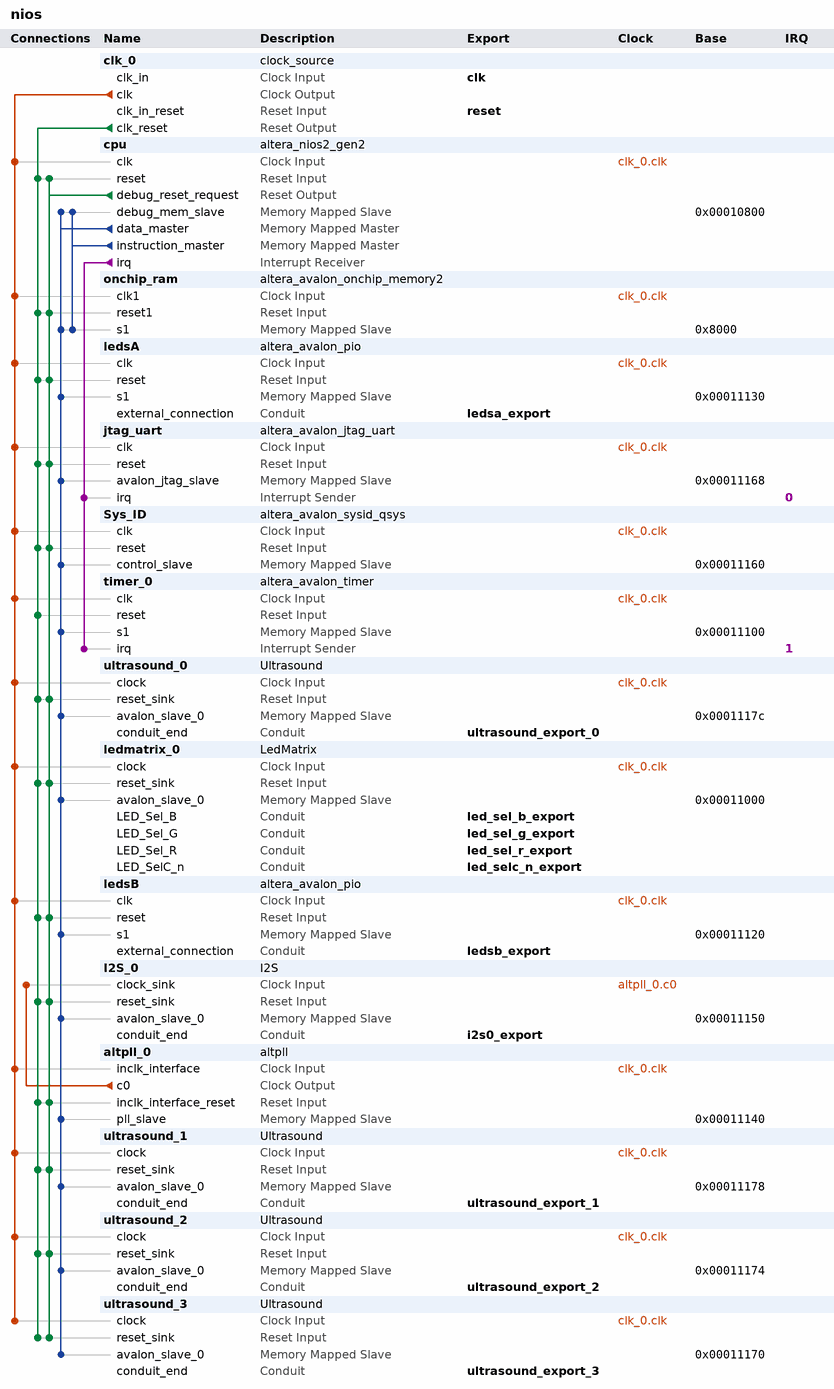
[diagram p0: system contents]
# Platform Designer (Qsys) system nios, Cyclone IV E EP4CE22F17C6
# Parameters at their usual value, and those the tool derives, are not listed.
package require -exact qsys 17.0
create_system nios
set_project_property DEVICE_FAMILY {Cyclone IV E}
set_project_property DEVICE EP4CE22F17C6

add_instance clk_0 clock_source 17.0
set_instance_parameter_value clk_0 clockFrequency 50000000

add_instance cpu altera_nios2_gen2 17.0
set_instance_parameter_value cpu dcache_size 2048
set_instance_parameter_value cpu exceptionSlave onchip_ram.s1
set_instance_parameter_value cpu icache_size 4096
set_instance_parameter_value cpu impl Fast
set_instance_parameter_value cpu resetSlave onchip_ram.s1

add_instance onchip_ram altera_avalon_onchip_memory2 17.0
set_instance_parameter_value onchip_ram dataWidth 32
set_instance_parameter_value onchip_ram dualPort false
set_instance_parameter_value onchip_ram initMemContent true
set_instance_parameter_value onchip_ram initializationFileName onchip_mem.hex
set_instance_parameter_value onchip_ram memorySize 32768

add_instance ledsA altera_avalon_pio 17.0
set_instance_parameter_value ledsA direction Output
set_instance_parameter_value ledsA width 8

add_instance jtag_uart altera_avalon_jtag_uart 17.0
set_instance_parameter_value jtag_uart simInteractiveOptions NO_INTERACTIVE_WINDOWS

add_instance Sys_ID altera_avalon_sysid_qsys 17.0
set_instance_parameter_value Sys_ID id 0

add_instance timer_0 altera_avalon_timer 17.0
set_instance_parameter_value timer_0 period 100
set_instance_parameter_value timer_0 periodUnits USEC

add_instance ultrasound_0 Ultrasound 1.0

add_instance ledmatrix_0 LedMatrix 1.0
set_instance_parameter_value ledmatrix_0 size 16

add_instance ledsB altera_avalon_pio 17.0
set_instance_parameter_value ledsB direction Output
set_instance_parameter_value ledsB width 8

add_instance I2S_0 I2S 1.0

add_instance altpll_0 altpll 17.0
set_instance_parameter_value altpll_0 CLK0_DIVIDE_BY 3125
set_instance_parameter_value altpll_0 CLK0_MULTIPLY_BY 512
set_instance_parameter_value altpll_0 INCLK0_INPUT_FREQUENCY 20000
set_instance_parameter_value altpll_0 PORT_ARESET PORT_UNUSED
set_instance_parameter_value altpll_0 PORT_LOCKED PORT_UNUSED
set_instance_parameter_value altpll_0 PORT_clk1 PORT_UNUSED
set_instance_parameter_value altpll_0 PORT_clk2 PORT_UNUSED
set_instance_parameter_value altpll_0 PORT_clk3 PORT_UNUSED

add_instance ultrasound_1 Ultrasound 1.0

add_instance ultrasound_2 Ultrasound 1.0

add_instance ultrasound_3 Ultrasound 1.0

# connections
add_connection altpll_0.c0 I2S_0.clock_sink clock
add_connection clk_0.clk altpll_0.inclk_interface clock
add_connection clk_0.clk cpu.clk clock
add_connection clk_0.clk jtag_uart.clk clock
add_connection clk_0.clk ledmatrix_0.clock clock
add_connection clk_0.clk ledsA.clk clock
add_connection clk_0.clk ledsB.clk clock
add_connection clk_0.clk onchip_ram.clk1 clock
add_connection clk_0.clk Sys_ID.clk clock
add_connection clk_0.clk timer_0.clk clock
add_connection clk_0.clk ultrasound_0.clock clock
add_connection clk_0.clk ultrasound_1.clock clock
add_connection clk_0.clk ultrasound_2.clock clock
add_connection clk_0.clk ultrasound_3.clock clock
add_connection clk_0.clk_reset altpll_0.inclk_interface_reset reset
add_connection clk_0.clk_reset cpu.reset reset
add_connection clk_0.clk_reset I2S_0.reset_sink reset
add_connection clk_0.clk_reset jtag_uart.reset reset
add_connection clk_0.clk_reset ledmatrix_0.reset_sink reset
add_connection clk_0.clk_reset ledsA.reset reset
add_connection clk_0.clk_reset ledsB.reset reset
add_connection clk_0.clk_reset onchip_ram.reset1 reset
add_connection clk_0.clk_reset Sys_ID.reset reset
add_connection clk_0.clk_reset timer_0.reset reset
add_connection clk_0.clk_reset ultrasound_0.reset_sink reset
add_connection clk_0.clk_reset ultrasound_1.reset_sink reset
add_connection clk_0.clk_reset ultrasound_2.reset_sink reset
add_connection clk_0.clk_reset ultrasound_3.reset_sink reset
add_connection cpu.debug_reset_request altpll_0.inclk_interface_reset reset
add_connection cpu.debug_reset_request cpu.reset reset
add_connection cpu.debug_reset_request I2S_0.reset_sink reset
add_connection cpu.debug_reset_request jtag_uart.reset reset
add_connection cpu.debug_reset_request ledmatrix_0.reset_sink reset
add_connection cpu.debug_reset_request ledsA.reset reset
add_connection cpu.debug_reset_request ledsB.reset reset
add_connection cpu.debug_reset_request onchip_ram.reset1 reset
add_connection cpu.debug_reset_request Sys_ID.reset reset
add_connection cpu.debug_reset_request ultrasound_0.reset_sink reset
add_connection cpu.debug_reset_request ultrasound_1.reset_sink reset
add_connection cpu.debug_reset_request ultrasound_2.reset_sink reset
add_connection cpu.debug_reset_request ultrasound_3.reset_sink reset
add_connection cpu.data_master altpll_0.pll_slave avalon
set_connection_parameter_value cpu.data_master/altpll_0.pll_slave baseAddress 0x00011140
add_connection cpu.data_master cpu.debug_mem_slave avalon
set_connection_parameter_value cpu.data_master/cpu.debug_mem_slave baseAddress 0x00010800
add_connection cpu.data_master I2S_0.avalon_slave_0 avalon
set_connection_parameter_value cpu.data_master/I2S_0.avalon_slave_0 baseAddress 0x00011150
add_connection cpu.data_master jtag_uart.avalon_jtag_slave avalon
set_connection_parameter_value cpu.data_master/jtag_uart.avalon_jtag_slave baseAddress 0x00011168
add_connection cpu.data_master ledmatrix_0.avalon_slave_0 avalon
set_connection_parameter_value cpu.data_master/ledmatrix_0.avalon_slave_0 baseAddress 0x00011000
add_connection cpu.data_master ledsA.s1 avalon
set_connection_parameter_value cpu.data_master/ledsA.s1 baseAddress 0x00011130
add_connection cpu.data_master ledsB.s1 avalon
set_connection_parameter_value cpu.data_master/ledsB.s1 baseAddress 0x00011120
add_connection cpu.data_master onchip_ram.s1 avalon
set_connection_parameter_value cpu.data_master/onchip_ram.s1 baseAddress 0x8000
add_connection cpu.data_master Sys_ID.control_slave avalon
set_connection_parameter_value cpu.data_master/Sys_ID.control_slave baseAddress 0x00011160
add_connection cpu.data_master timer_0.s1 avalon
set_connection_parameter_value cpu.data_master/timer_0.s1 baseAddress 0x00011100
add_connection cpu.data_master ultrasound_0.avalon_slave_0 avalon
set_connection_parameter_value cpu.data_master/ultrasound_0.avalon_slave_0 baseAddress 0x0001117c
add_connection cpu.data_master ultrasound_1.avalon_slave_0 avalon
set_connection_parameter_value cpu.data_master/ultrasound_1.avalon_slave_0 baseAddress 0x00011178
add_connection cpu.data_master ultrasound_2.avalon_slave_0 avalon
set_connection_parameter_value cpu.data_master/ultrasound_2.avalon_slave_0 baseAddress 0x00011174
add_connection cpu.data_master ultrasound_3.avalon_slave_0 avalon
set_connection_parameter_value cpu.data_master/ultrasound_3.avalon_slave_0 baseAddress 0x00011170
add_connection cpu.instruction_master cpu.debug_mem_slave avalon
set_connection_parameter_value cpu.instruction_master/cpu.debug_mem_slave baseAddress 0x00010800
add_connection cpu.instruction_master onchip_ram.s1 avalon
set_connection_parameter_value cpu.instruction_master/onchip_ram.s1 baseAddress 0x8000
add_connection cpu.irq jtag_uart.irq interrupt
set_connection_parameter_value cpu.irq/jtag_uart.irq irqNumber 0
add_connection cpu.irq timer_0.irq interrupt
set_connection_parameter_value cpu.irq/timer_0.irq irqNumber 1

# exported interfaces
add_interface clk clock sink
set_interface_property clk EXPORT_OF clk_0.clk_in
add_interface i2s0_export conduit end
set_interface_property i2s0_export EXPORT_OF I2S_0.conduit_end
add_interface led_sel_b_export conduit end
set_interface_property led_sel_b_export EXPORT_OF ledmatrix_0.LED_Sel_B
add_interface led_sel_g_export conduit end
set_interface_property led_sel_g_export EXPORT_OF ledmatrix_0.LED_Sel_G
add_interface led_sel_r_export conduit end
set_interface_property led_sel_r_export EXPORT_OF ledmatrix_0.LED_Sel_R
add_interface led_selc_n_export conduit end
set_interface_property led_selc_n_export EXPORT_OF ledmatrix_0.LED_SelC_n
add_interface ledsa_export conduit end
set_interface_property ledsa_export EXPORT_OF ledsA.external_connection
add_interface ledsb_export conduit end
set_interface_property ledsb_export EXPORT_OF ledsB.external_connection
add_interface reset reset sink
set_interface_property reset EXPORT_OF clk_0.clk_in_reset
add_interface ultrasound_export_0 conduit end
set_interface_property ultrasound_export_0 EXPORT_OF ultrasound_0.conduit_end
add_interface ultrasound_export_1 conduit end
set_interface_property ultrasound_export_1 EXPORT_OF ultrasound_1.conduit_end
add_interface ultrasound_export_2 conduit end
set_interface_property ultrasound_export_2 EXPORT_OF ultrasound_2.conduit_end
add_interface ultrasound_export_3 conduit end
set_interface_property ultrasound_export_3 EXPORT_OF ultrasound_3.conduit_end

set_interconnect_requirement {$system} qsys_mm.clockCrossingAdapter HANDSHAKE
set_interconnect_requirement {$system} qsys_mm.enableEccProtection FALSE
set_interconnect_requirement {$system} qsys_mm.insertDefaultSlave FALSE
set_interconnect_requirement {$system} qsys_mm.maxAdditionalLatency 1

save_system nios.qsys
